# EAGLE design i2c_adc (EAGLE 9.6.2)
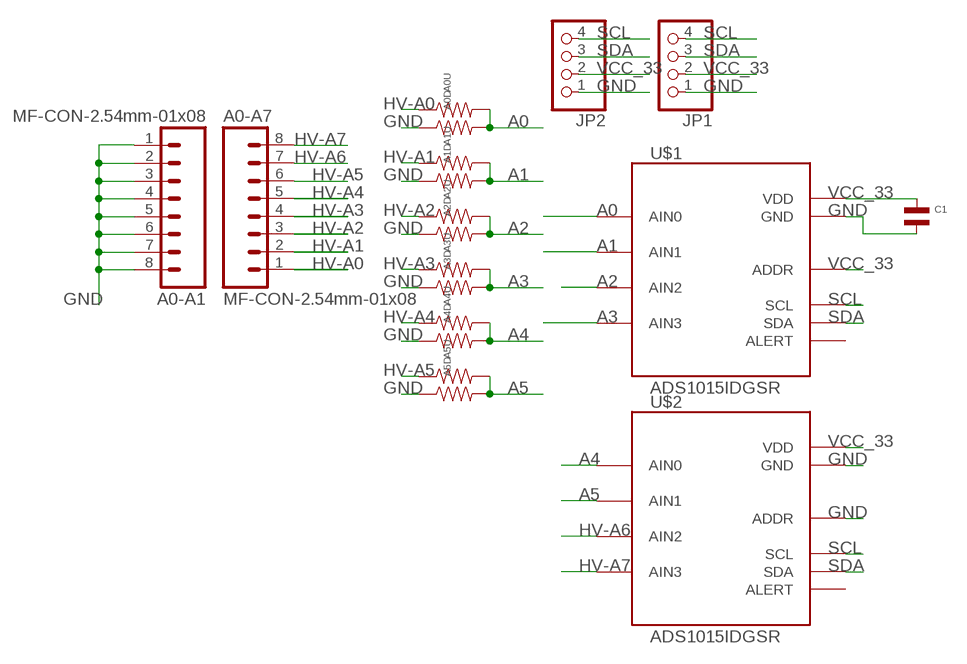
[diagram p0: schematic, sheet 1]

## Parts
A0-A1  MF-CON-2.54mm-01x08  M081X08  [1X08]
A0-A7  MF-CON-2.54mm-01x08  M081X08  [1X08]
A0D  RESISTOR_0603  [R0603]
A0U  RESISTOR_0603  [R0603]
A1D  RESISTOR_0603  [R0603]
A1U  RESISTOR_0603  [R0603]
A2D  RESISTOR_0603  [R0603]
A2U  RESISTOR_0603  [R0603]
A3D  RESISTOR_0603  [R0603]
A3U  RESISTOR_0603  [R0603]
A4D  RESISTOR_0603  [R0603]
A4U  RESISTOR_0603  [R0603]
A5D  RESISTOR_0603  [R0603]
A5U  RESISTOR_0603  [R0603]
C1  CAPACITOR_NP_1206  [C1206]
JP1  HEADER-1X41MMPADS  [1X04_1.0MM]
JP2  HEADER-1X41MMPADS  [1X04_1.0MM]
U$1  ADS1015IDGSR  ADS1015IDGT  [MSOP10_0.5]
U$2  ADS1015IDGSR  ADS1015IDGT  [MSOP10_0.5]

## Nets
A0: A0D.P$2 A0U.P$2 U$1.4(AIN0)
A1: A1D.P$2 A1U.P$2 U$1.5(AIN1)
A2: A2D.P$2 A2U.P$2 U$1.6(AIN2)
A3: A3D.P$2 A3U.P$2 U$1.7(AIN3)
A4: A4D.P$2 A4U.P$2 U$2.4(AIN0)
A5: A5D.P$2 A5U.P$2 U$2.5(AIN1)
GND: A0-A1.1 A0-A1.2 A0-A1.3 A0-A1.4 A0-A1.5 A0-A1.6 A0-A1.7 A0-A1.8 A0D.P$1 A1D.P$1 A2D.P$1 A3D.P$1 A4D.P$1 A5D.P$1 C1.P$2 JP1.1 JP2.1 U$1.3(GND) U$2.1(ADDR) U$2.3(GND)
HV-A0: A0-A7.1 A0U.P$1
HV-A1: A0-A7.2 A1U.P$1
HV-A2: A0-A7.3 A2U.P$1
HV-A3: A0-A7.4 A3U.P$1
HV-A4: A0-A7.5 A4U.P$1
HV-A5: A0-A7.6 A5U.P$1
HV-A6: A0-A7.7 U$2.6(AIN2)
HV-A7: A0-A7.8 U$2.7(AIN3)
SCL: JP1.4 JP2.4 U$1.10(SCL) U$2.10(SCL)
SDA: JP1.3 JP2.3 U$1.9(SDA) U$2.9(SDA)
VCC_33: C1.P$1 JP1.2 JP2.2 U$1.1(ADDR) U$1.8(VDD) U$2.8(VDD)
Unconnected: U$1.2(ALERT) U$2.2(ALERT)

## Library data of the parts
A0-A1 A0-A7 = SparkFun-Connectors:M08: Header 8 Standard 8-pin 0.1" header. Use with straight break away headers (SKU : PRT-00116), right angle break away headers (PRT-00553), swiss pins (PRT-00743), machine pins (PRT-00117), and female headers (PRT-00115).
A0D A0U A1D A1U A2D A2U A3D A3U A4D A4U A5D A5U = MF_Passives:RESISTOR: Library: MF_Passives Description: Device for Resistors. Manufacture part number (MPN), Voltage, Tolerance, and Wattage Rating can be added via Attributes. Check https://factory.macrofab.com/parts for the house parts list.; POPULATE: 1
C1 = 00jim:CAPACITOR_NP: Library: MF_Passives Description: Device for Non-Polarized Capacitors. Manufacture part number (MPN) can be added via Attributes. Check https://factory.macrofab.com/parts for the house parts list.; POPULATE: 1
JP1 JP2 = 00jim:HEADER-1X4: PIN HEADER
U$1 U$2 = bt_adc:ADS1015: Ti ADS1015 12-bit ADC Ultra-Small, Low-Power, 12-Bit Analog-to-Digital Converter with Internal Reference The ADS1013, ADS1014, and ADS1015 are precision analog-to-digital converters (ADCs) with 12 bits of resolution offered in an ultra-small, leadless QFN-10 package or an MSOP-10 package. \ Source: http://focus.ti.com/docs/prod/folders/print/ads1015.html

## Net classes
0 default: width 0.229 mm

## Board
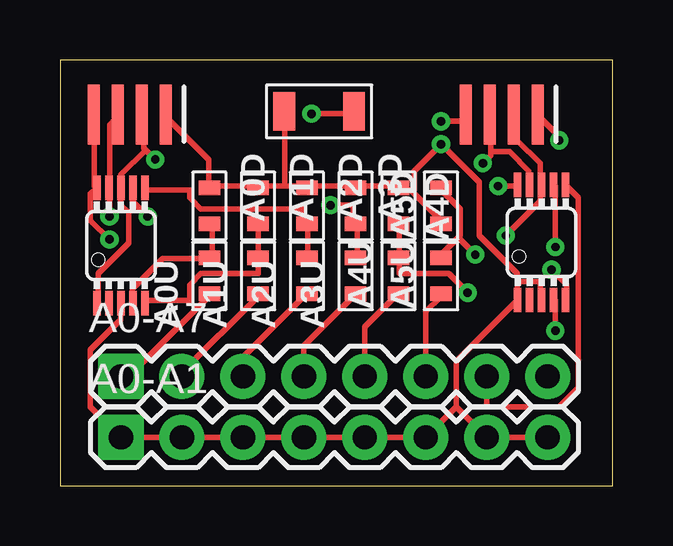
[diagram p1: board, top side]
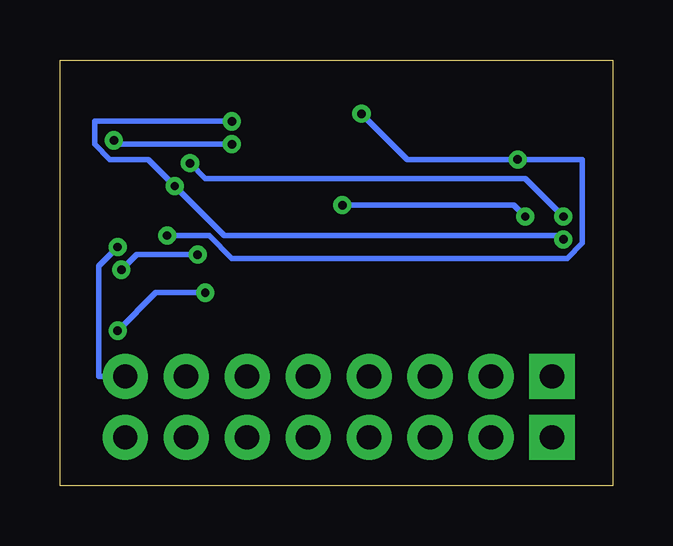
[diagram p2: board, bottom side, seen from below]

Size 23.04 x 17.77 mm. Coordinates in mm from the lower left corner, seen from the top.
Outline: 0,0 23.04,0 23.04,17.77 0,17.77 0,0
Copper layers (1*16): Top 0.035mm / dielectric 1.5mm / Bottom 0.035mm
Design rules "default *": minimum track width 6mil, minimum drill 0.35mm, track to track 6mil, track to pad 6mil, pad to pad 6mil, via to via 6mil, smd to smd 6mil, copper to edge 40mil, drill to drill 6mil, minimum pad ring 10mil, minimum via ring 8mil, stop-mask expansion 4mil, vias tented up to drill 0mil, thermal gap 10mil

### Footprints (pad centres in the part's own frame; a part is rotated, then mirrored left to right if it is on the bottom)
1X08 = drill 1.016 pad 1.88 square: 1 0,0 | drill 1.016 pad 1.88: 2 2.54,0; 3 5.08,0; 4 7.62,0; 5 10.16,0; 6 12.7,0; 7 15.24,0; 8 17.78,0
R0603 = smd 0.6 x 0.9: P$1 -0.75,0; P$2 0.75,0
C1206 = smd 0.9 x 1.6: P$1 -1.45,0; P$2 1.45,0
1X04_1.0MM = smd 0.5 x 2.5: 1 -2,0; 2 -1,0; 3 0,0; 4 1,0
MSOP10_0.5 = smd 0.3 x 1.02: 1 -1,-2.4; 2 -0.5,-2.4; 3 0,-2.4; 4 0.5,-2.4; 5 1,-2.4; 6 1,2.4; 7 0.5,2.4; 8 0,2.4; 9 -0.5,2.4; 10 -1,2.4

### Placement (x,y rotation side)
A0-A1  2.54,2.03 0 top
A0-A7  2.54,4.57 0 top
A0D  6.22,11.68 270 top
A0U  6.22,8.76 90 top
A1D  8.26,11.68 270 top
A1U  8.26,8.76 90 top
A2D  10.29,11.68 270 top
A2U  10.29,8.76 90 top
A3D  12.32,11.68 270 top
A3U  12.32,8.76 90 top
A4D  14.1,11.68 270 top
A4U  14.1,8.76 90 top
A5D  15.88,11.68 90 top
A5U  15.88,8.76 90 top
C1  10.79,15.62 180 top
JP1  17.91,15.49 180 top
JP2  2.41,15.49 180 top
U$1  2.54,10.03 0 top
U$2  20.07,10.16 0 top

### Tracks (layer width: path | path; a pad name or v marks a point on that pad's centre or on a via)
A0
  Top 0.229: A0D.P$2 6.35,10.92 6.35,9.65 A0U.P$2 6.19,9.49 4.29,9.49 3.02,8.22 3.02,7.75 U$1.4
A1
  Top 0.229: A1D.P$2 A1U.P$2 8.26,8.86 5.87,8.86 5.4,8.38 5.4,7.75 3.65,7.75 U$1.5
A2
  Top 0.229: A2U.P$2 10.32,9.65 10.32,10.92 A2D.P$2 10.16,11.08 10.16,11.56 5.87,11.56 5.4,12.03 5.4,12.35 3.65,12.35 U$1.6
A3  (via drill 0.35)
  Top 0.229: A3U.P$2 12.38,9.65 12.38,10.92 A3D.P$2 12.22,11.08 12.22,11.72 v11.27,11.72 | v3.65,11.24 3.02,11.87 3.02,12.35 U$1.7
  Bottom 0.229: v3.65,11.24 4.13,11.72 v11.27,11.72
A4  (via drill 0.35)
  Top 0.229: A4D.P$2 14.13,10.92 14.13,9.65 A4U.P$2 14.13,9.49 14.13,8.86 16.19,8.86 v16.99,8.06 | v20.64,6.48 20.64,7.75 U$2.4
  Bottom 0.229: v20.64,6.48 19.05,8.06 v16.99,8.06
A5  (via drill 0.35)
  Top 0.229: 16.59,10.37 16.67,10.45 16.67,11.56 15.88,12.35 A5D.P$2 | 16.59,10.37 15.88,9.65 A5U.P$2 | v20.48,9.02 21.11,8.38 21.11,7.91 U$2.5 | 16.59,10.37 v17.3,9.65
  Bottom 0.229: v20.48,9.02 19.84,9.65 v17.3,9.65
GND  (via drill 0.35)
  Top 0.229: 8.26,12.51 6.35,12.51 A0D.P$1 6.19,12.51 6.19,13.62 4.45,15.37 JP2.1 | 14.68,12.27 14.61,12.35 14.13,12.35 A4D.P$1 13.97,12.51 12.38,12.51 A3D.P$1 12.22,12.51 10.32,12.51 A2D.P$1 10.16,12.51 9.37,12.51 | 14.68,12.27 15.88,11.08 A5D.P$1 | 9.37,12.51 8.26,12.51 | 8.26,12.51 A1D.P$1 | 9.37,12.51 9.37,15.53 C1.P$2 | v20.8,14.41 20.8,14.57 20,15.37 JP1.1 | 14.68,12.27 14.76,12.35 14.76,13.14 v15.88,14.26 17.46,12.67 17.46,10.45 19.05,8.86 19.05,8.54 19.13,8.46 | 19.13,8.46 19.21,8.54 20,8.54 20,7.91 U$2.3 | 19.13,8.46 19.05,8.38 19.05,7.91 U$2.1 19.05,7.75 16.51,5.21 16.51,3.3 | 16.51,3.3 A0-A1.6 A0-A1.5 A0-A1.4 A0-A1.3 A0-A1.2 A0-A1.1 1.27,3.3 1.27,5.68 2.54,6.95 U$1.3 | 16.51,3.3 A0-A1.7 A0-A1.8
  Bottom 0.229: v20.8,14.41 20.64,14.26 v15.88,14.26
HV-A0
  Top 0.229: A0-A7.1 2.86,4.57 6.19,7.91 A0U.P$1
HV-A1
  Top 0.229: A0-A7.2 5.08,4.73 8.26,7.91 A1U.P$1
HV-A2
  Top 0.229: A0-A7.3 7.62,5.37 10.16,7.91 A2U.P$1
HV-A3
  Top 0.229: A0-A7.4 10.16,5.84 12.22,7.91 A3U.P$1
HV-A4
  Top 0.229: A0-A7.5 12.7,6.64 13.97,7.91 A4U.P$1
HV-A5
  Top 0.229: A0-A7.6 15.24,7.27 15.88,7.91 A5U.P$1
HV-A6
  Top 0.229: A0-A7.7 17.78,3.3 20.8,3.3 21.59,4.1 21.59,12.03 21.11,12.51 U$2.6
HV-A7  (via drill 0.35)
  Top 0.229: v20.64,9.97 20.64,12.51 U$2.7
  Bottom 0.229: v20.64,9.97 21.43,9.18 21.43,4.57 A0-A7.8
SCL  (via drill 0.35)
  Top 0.229: JP2.4 1.43,15.37 1.43,12.51 U$1.10 1.43,12.35 1.27,12.19 1.27,11.08 v2.06,10.29 | v18.26,12.51 19.05,12.51 U$2.10 | v15.88,15.21 16.83,15.21 16.83,15.37 JP1.4
  Bottom 0.229: v15.88,15.21 21.59,15.21 21.59,14.26 20.95,13.62 19.37,13.62 v18.26,12.51 16.19,10.45 2.22,10.45 v2.06,10.29
SDA  (via drill 0.35)
  Top 0.229: JP2.3 2.38,15.37 2.06,15.05 2.06,12.51 U$1.9 2.06,12.35 v2.06,11.24 | 17.94,13.94 18.73,13.94 19.53,13.14 19.53,12.67 U$2.9 | 17.94,13.94 17.94,15.37 JP1.3 | v17.62,13.46 17.94,13.78 17.94,13.94
  Bottom 0.229: v2.06,11.24 3.65,12.83 16.99,12.83 v17.62,13.46
VCC_33  (via drill 0.35)
  Top 0.229: JP1.2 19.05,15.37 19.05,14.41 20,13.46 20,12.67 U$2.8 20,12.51 20,11.87 v18.57,10.45 | U$1.1 1.59,7.75 1.59,8.86 2.86,10.13 2.86,11.4 2.54,11.72 U$1.8 2.54,12.99 3.57,14.02 | v10.48,15.53 12.22,15.53 C1.P$1 | 3.57,14.02 3.49,14.1 3.49,15.37 JP2.2 | 3.57,14.02 v3.97,13.62
  Bottom 0.229: v10.48,15.53 8.57,13.62 v3.97,13.62 1.27,13.62 1.27,10.13 1.91,9.49 15.88,9.49 16.83,10.45 v18.57,10.45